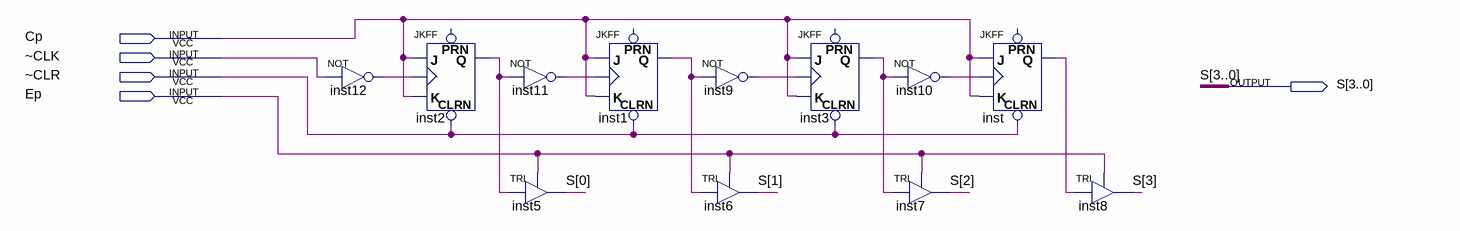
[diagram p0: schematic sheet]
// Quartus schematic Contador_De_Programa.bdf as structural Verilog: 12 symbols, 5 pins
module Contador_De_Programa (
  input  Cp,
  input  \~CLK ,
  input  \~CLR ,
  input  Ep,
  output [3:0] S
);

  wire inst1_q, inst2_q, inst3_q, inst9_out, inst10_out, inst11_out, inst12_out, inst_q;

  not inst12 (inst12_out, \~CLK );
  JKFF inst2 (.CLRN(\~CLR ), .K(Cp), .J(Cp), .CLK(inst12_out), .Q(inst2_q));  // open: PRN
  not inst11 (inst11_out, inst2_q);
  TRI inst5 (.IN(inst2_q), .OE(Ep), .OUT(S[0]));
  JKFF inst1 (.CLRN(\~CLR ), .K(Cp), .J(Cp), .CLK(inst11_out), .Q(inst1_q));  // open: PRN
  not inst9 (inst9_out, inst1_q);
  TRI inst6 (.IN(inst1_q), .OE(Ep), .OUT(S[1]));
  JKFF inst3 (.CLRN(\~CLR ), .K(Cp), .J(Cp), .CLK(inst9_out), .Q(inst3_q));  // open: PRN
  not inst10 (inst10_out, inst3_q);
  TRI inst7 (.IN(inst3_q), .OE(Ep), .OUT(S[2]));
  JKFF inst (.CLRN(\~CLR ), .K(Cp), .J(Cp), .CLK(inst10_out), .Q(inst_q));  // open: PRN
  TRI inst8 (.IN(inst_q), .OE(Ep), .OUT(S[3]));
endmodule
